# Altium schematic sheet Hammerhead - LPC4337 MCU R1.1.SchDoc
size C; SheetNumber: 2
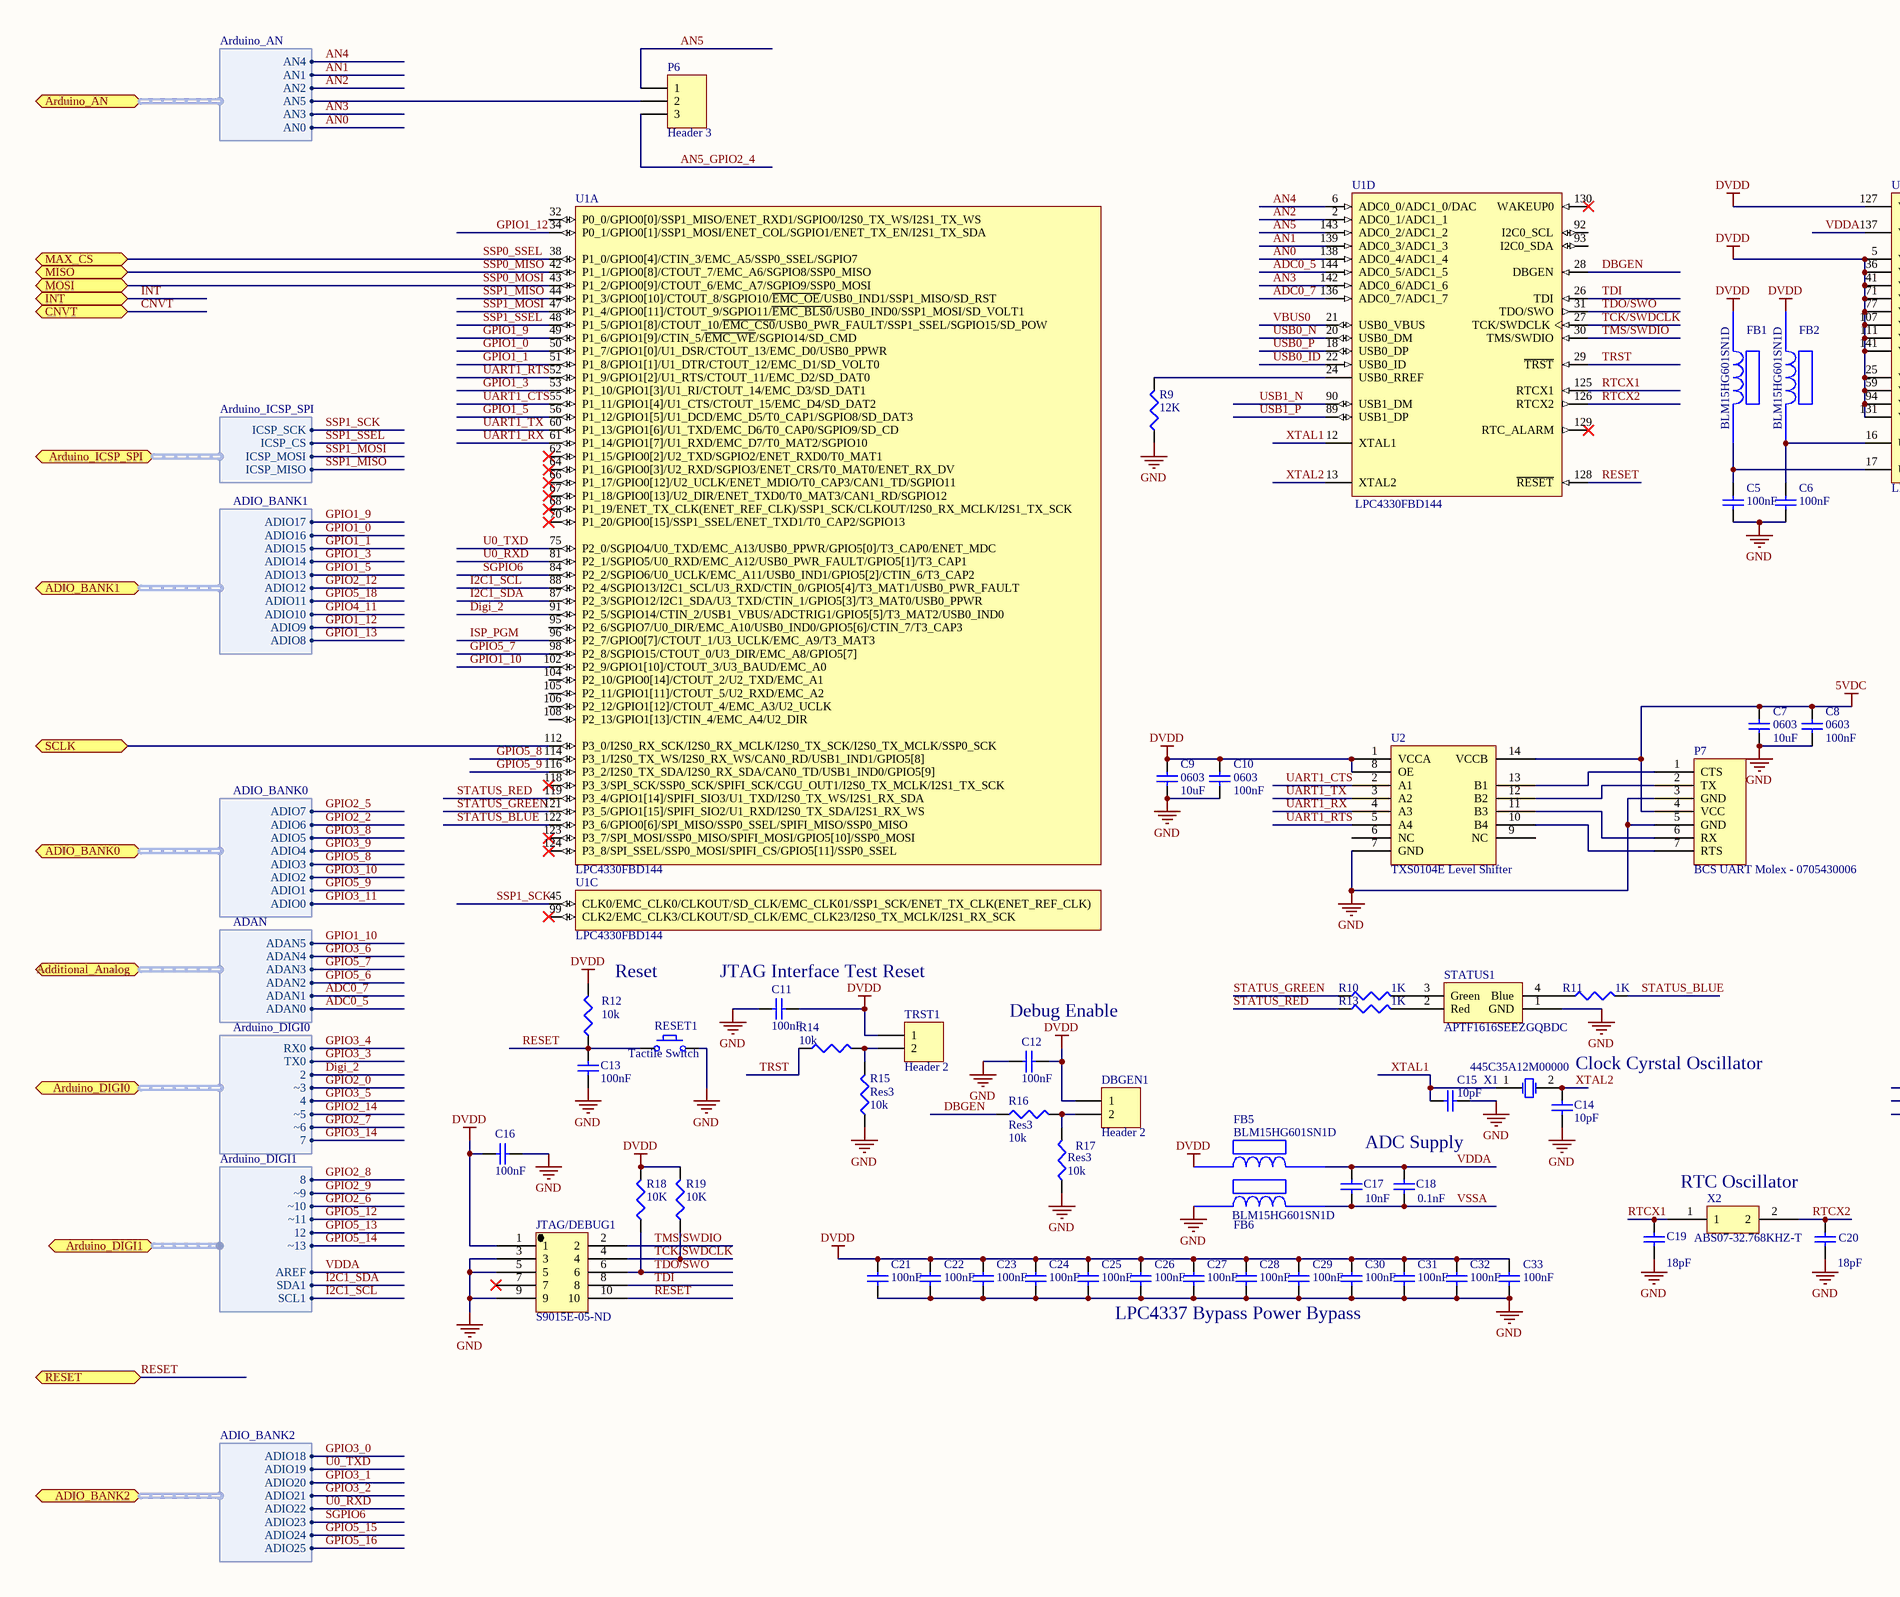
[diagram p0: Hammerhead - LPC4337 MCU R1.1.SchDoc, left]
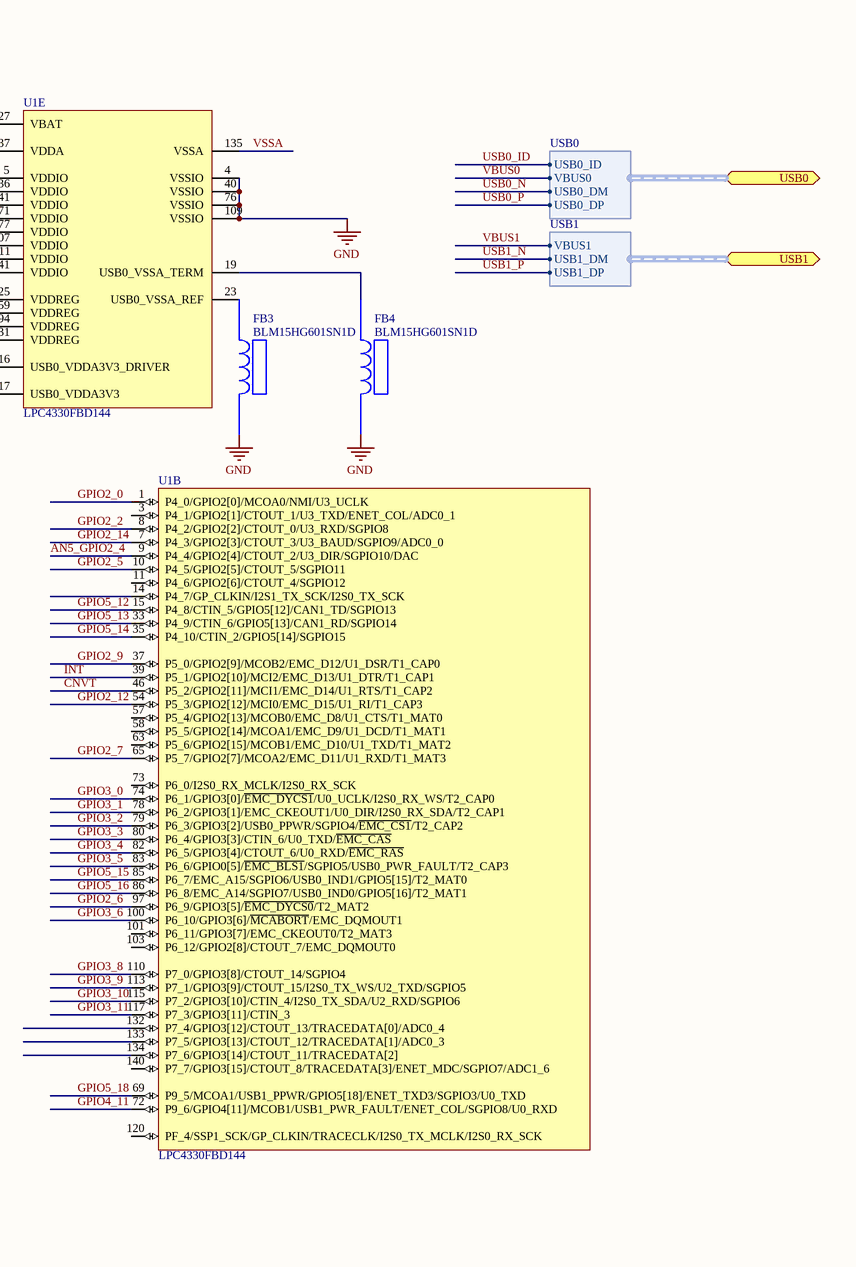
[diagram p1: Hammerhead - LPC4337 MCU R1.1.SchDoc, right]

## Parts
C5  value 100nF  [1608[0603]]  (hidden comment: Cap Semi)
C6  value 100nF  [1608[0603]]  (hidden comment: Cap Semi)
C7  0603  value 10uF  [1608[0603]]
C8  0603  value 100nF  [1608[0603]]
C9  0603  value 10uF  [1608[0603]]
C10  0603  value 100nF  [1608[0603]]
C11  value 100nF  [1608[0603]]  (hidden comment: Cap Semi)
C12  value 100nF  [1608[0603]]  (hidden comment: Cap Semi)
C13  value 100nF  [1608[0603]]  (hidden comment: Cap Semi)
C14  value 10pF  [1608[0603]]  (hidden comment: Cap Semi)
C15  value 10pF  [1608[0603]]  (hidden comment: Cap Semi)
C16  value 100nF  [1608[0603]]  (hidden comment: Cap Semi)
C17  value 10nF  [1608[0603]]  (hidden comment: Cap Semi)
C18  value 0.1nF  [1608[0603]]  (hidden comment: Cap Semi)
C19  value 18pF  [1608[0603]]  (hidden comment: Cap Semi)
C20  value 18pF  [1608[0603]]  (hidden comment: Cap Semi)
C21  value 100nF  [1608[0603]]  (hidden comment: Cap Semi)
C22  value 100nF  [1608[0603]]  (hidden comment: Cap Semi)
C23  value 100nF  [1608[0603]]  (hidden comment: Cap Semi)
C24  value 100nF  [1608[0603]]  (hidden comment: Cap Semi)
C25  value 100nF  [1608[0603]]  (hidden comment: Cap Semi)
C26  value 100nF  [1608[0603]]  (hidden comment: Cap Semi)
C27  value 100nF  [1608[0603]]  (hidden comment: Cap Semi)
C28  value 100nF  [1608[0603]]  (hidden comment: Cap Semi)
C29  value 100nF  [1608[0603]]  (hidden comment: Cap Semi)
C30  value 100nF  [1608[0603]]  (hidden comment: Cap Semi)
C31  value 100nF  [1608[0603]]  (hidden comment: Cap Semi)
C32  value 100nF  [1608[0603]]  (hidden comment: Cap Semi)
C33  value 100nF  [1608[0603]]  (hidden comment: Cap Semi)
DBGEN1  Header 2  [HDR1X2]
FB1  BLM15HG601SN1D  [BLM18PG121SN1D]
FB2  BLM15HG601SN1D  [BLM18PG121SN1D]
FB3  BLM15HG601SN1D  [BLM18PG121SN1D]
FB4  BLM15HG601SN1D  [BLM18PG121SN1D]
FB5  BLM15HG601SN1D  [BLM18PG121SN1D]
FB6  BLM15HG601SN1D  [BLM18PG121SN1D]
JTAG/DEBUG1  S9015E-05-ND  [S9015E-05-ND]
P6  Header 3  [HDR1X3]
P7  BCS UART Molex - 0705430006  [BCS Serial Port - Molex]
R9  value 12K  [J1-0603]  (hidden comment: Res3)
R10  value 1K  [J1-0603]  (hidden comment: Res3)
R11  value 1K  [J1-0603]  (hidden comment: Res3)
R12  value 10k  [J1-0603]  (hidden comment: Res3)
R13  value 1K  [J1-0603]  (hidden comment: Res3)
R14  value 10k  [J1-0603]  (hidden comment: Res3)
R15  Res3  value 10k  [J1-0603]
R16  Res3  value 10k  [J1-0603]
R17  Res3  value 10k  [J1-0603]
R18  value 10K  [J1-0603]  (hidden comment: Res3)
R19  value 10K  [J1-0603]  (hidden comment: Res3)
RESET1  Tactile Switch  [TL3301]
STATUS1  APTF1616SEEZGQBDC  [RGB LED APTF1616SEEZGQBDC]
TRST1  Header 2  [HDR1X2]
U1  LPC4330FBD144  [SOT486-1_V]  (parts A,B,C,D,E of 5)
U2  TXS0104E Level Shifter  [RGY  (S-PVQFN-N14)]
X1  445C35A12M00000  [445C35A12M00000]
X2  ABS07-32.768KHZ-T  [ABS07-32.768KHZ-T]

## Ports
Additional_Analog (harness ADAN), ADIO_BANK0 (harness ADIO_BANK0), ADIO_BANK1 (harness ADIO_BANK1), ADIO_BANK2 (harness ADIO_BANK2), Arduino_AN (harness Arduino_AN), Arduino_DIGI0 (harness Arduino_DIGI0), Arduino_DIGI1 (harness Arduino_DIGI1), Arduino_ICSP_SPI (harness Arduino_ICSP_SPI), CNVT, INT, MAX_CS, MISO, MOSI, RESET, SCLK, USB0 (harness USB0), USB1 (harness USB1)

## Harnesses
Arduino_AN: AN0, AN1, AN2, AN3, AN4, AN5
ADIO_BANK0: ADIO0, ADIO1, ADIO2, ADIO3, ADIO4, ADIO5, ADIO6, ADIO7
ADIO_BANK1: ADIO17, ADIO16, ADIO15, ADIO14, ADIO13, ADIO12, ADIO10, ADIO9, ADIO8, ADIO11
Arduino_DIGI0: 7, ~6, ~5, 4, ~3, 2, TX0, RX0
ADAN: ADAN0, ADAN1, ADAN2, ADAN3, ADAN4, ADAN5
USB1: VBUS1, USB1_DM, USB1_DP
USB0: USB0_ID, VBUS0, USB0_DM, USB0_DP
Arduino_ICSP_SPI: ICSP_MOSI, ICSP_MISO, ICSP_SCK, ICSP_CS
Arduino_DIGI1: 8, ~9, ~10, ~11, 12, ~13, AREF, SDA1, SCL1
ADIO_BANK2: ADIO18, ADIO19, ADIO20, ADIO21, ADIO22, ADIO23, ADIO24, ADIO25

## Nets
5VDC: C7.2 C8.2 P7.4(VCC) U2.14(VCCB)
DVDD: C9.2 C10.2 C11.2 C12.2 C16.1 C21.2 C22.2 C23.2 C24.2 C25.2 C26.2 C27.2 C28.2 C29.2 C30.2 C31.2 C32.2 C33.2 DBGEN1.1 FB1.1 FB2.1 FB5.1 JTAG/DEBUG1.1 R12.2 R18.2 R19.2 TRST1.1 U1.5(VDDIO) U1.25(VDDREG) U1.36(VDDIO) U1.41(VDDIO) U1.59(VDDREG) U1.71(VDDIO) U1.77(VDDIO) U1.94(VDDREG) U1.107(VDDIO) U1.111(VDDIO) U1.127(VBAT) U1.131(VDDREG) U1.141(VDDIO) U2.1(VCCA) U2.8(OE)
GND: C5.1 C6.1 C7.1 C8.1 C9.1 C10.1 C11.1 C12.1 C13.1 C14.1 C15.1 C16.2 C19.1 C20.1 C21.1 C22.1 C23.1 C24.1 C25.1 C26.1 C27.1 C28.1 C29.1 C30.1 C31.1 C32.1 C33.1 FB3.2 FB4.2 FB6.1 JTAG/DEBUG1.3 JTAG/DEBUG1.5 JTAG/DEBUG1.9 P7.3(GND) P7.5(GND) R9.1 R15.1 R17.1 RESET1.2 STATUS1.1(GND) U1.4(VSSIO) U1.40(VSSIO) U1.76(VSSIO) U1.109(VSSIO) U2.7(GND)
ADC0_5: U1.144(ADC0_5/ADC1_5) ; port Additional_Analog.ADAN0
ADC0_7: U1.136(ADC0_7/ADC1_7) ; port Additional_Analog.ADAN1
AN0: U1.138(ADC0_4/ADC1_4) ; port Arduino_AN.AN0
AN1: U1.139(ADC0_3/ADC1_3) ; port Arduino_AN.AN1
AN2: U1.2(ADC0_1/ADC1_1) ; port Arduino_AN.AN2
AN3: U1.142(ADC0_6/ADC1_6) ; port Arduino_AN.AN3
AN4: U1.6(ADC0_0/ADC1_0/DAC) ; port Arduino_AN.AN4
AN5: P6.1 U1.143(ADC0_2/ADC1_2)
AN5_GPIO2_4: P6.3 U1.9(P4_4/GPIO2[4]/CTOUT_2/U3_DIR/SGPIO10/DAC)
CNVT: U1.46(P5_2/GPIO2[11]/MCI1/EMC_D14/U1_RTS/T1_CAP2) ; port CNVT
DBGEN: R16.1 U1.28(DBGEN)
Digi_2: U1.91(P2_5/SGPIO14/CTIN_2/USB1_VBUS/ADCTRIG1/GPIO5[5]/T3_MAT2/USB0_IND0) ; port Arduino_DIGI0.2
GPIO1_0: U1.50(P1_7/GPIO1[0]/U1_DSR/CTOUT_13/EMC_D0/USB0_PPWR) ; port ADIO_BANK1.ADIO16
GPIO1_1: U1.51(P1_8/GPIO1[1]/U1_DTR/CTOUT_12/EMC_D1/SD_VOLT0) ; port ADIO_BANK1.ADIO15
GPIO1_3: U1.53(P1_10/GPIO1[3]/U1_RI/CTOUT_14/EMC_D3/SD_DAT1) ; port ADIO_BANK1.ADIO14
GPIO1_5: U1.56(P1_12/GPIO1[5]/U1_DCD/EMC_D5/T0_CAP1/SGPIO8/SD_DAT3) ; port ADIO_BANK1.ADIO13
GPIO1_9: U1.49(P1_6/GPIO1[9]/CTIN_5/~{EMC_WE}/SGPIO14/SD_CMD) ; port ADIO_BANK1.ADIO17
GPIO1_10: U1.102(P2_9/GPIO1[10]/CTOUT_3/U3_BAUD/EMC_A0) ; port Additional_Analog.ADAN5
GPIO1_12: U1.34(P0_1/GPIO0[1]/SSP1_MOSI/ENET_COL/SGPIO1/ENET_TX_EN/I2S1_TX_SDA) ; port ADIO_BANK1.ADIO9
GPIO1_13: port ADIO_BANK1.ADIO8
GPIO2_0: U1.1(P4_0/GPIO2[0]/MCOA0/NMI/U3_UCLK) ; port Arduino_DIGI0.~3
GPIO2_2: U1.8(P4_2/GPIO2[2]/CTOUT_0/U3_RXD/SGPIO8) ; port ADIO_BANK0.ADIO6
GPIO2_5: U1.10(P4_5/GPIO2[5]/CTOUT_5/SGPIO11) ; port ADIO_BANK0.ADIO7
GPIO2_6: U1.97(P6_9/GPIO3[5]/~{EMC_DYCS0}/T2_MAT2) ; port Arduino_DIGI1.~10
GPIO2_7: U1.65(P5_7/GPIO2[7]/MCOA2/EMC_D11/U1_RXD/T1_MAT3) ; port Arduino_DIGI0.~6
GPIO2_8: port Arduino_DIGI1.8
GPIO2_9: U1.37(P5_0/GPIO2[9]/MCOB2/EMC_D12/U1_DSR/T1_CAP0) ; port Arduino_DIGI1.~9
GPIO2_12: U1.54(P5_3/GPIO2[12]/MCI0/EMC_D15/U1_RI/T1_CAP3) ; port ADIO_BANK1.ADIO12
GPIO2_14: U1.7(P4_3/GPIO2[3]/CTOUT_3/U3_BAUD/SGPIO9/ADC0_0) ; port Arduino_DIGI0.~5
GPIO3_0: U1.74(P6_1/GPIO3[0]/~{EMC_DYCS1}/U0_UCLK/I2S0_RX_WS/T2_CAP0) ; port ADIO_BANK2.ADIO18
GPIO3_1: U1.78(P6_2/GPIO3[1]/EMC_CKEOUT1/U0_DIR/I2S0_RX_SDA/T2_CAP1) ; port ADIO_BANK2.ADIO20
GPIO3_2: U1.79(P6_3/GPIO3[2]/USB0_PPWR/SGPIO4/~{EMC_CS1}/T2_CAP2) ; port ADIO_BANK2.ADIO21
GPIO3_3: U1.80(P6_4/GPIO3[3]/CTIN_6/U0_TXD/~{EMC_CAS}) ; port Arduino_DIGI0.TX0
GPIO3_4: U1.82(P6_5/GPIO3[4]/CTOUT_6/U0_RXD/~{EMC_RAS}) ; port Arduino_DIGI0.RX0
GPIO3_5: U1.83(P6_6/GPIO0[5]/~{EMC_BLS1}/SGPIO5/USB0_PWR_FAULT/T2_CAP3) ; port Arduino_DIGI0.4
GPIO3_6: U1.100(P6_10/GPIO3[6]/~{MCABORT}/EMC_DQMOUT1) ; port Additional_Analog.ADAN4
GPIO3_8: U1.110(P7_0/GPIO3[8]/CTOUT_14/SGPIO4) ; port ADIO_BANK0.ADIO5
GPIO3_9: U1.113(P7_1/GPIO3[9]/CTOUT_15/I2S0_TX_WS/U2_TXD/SGPIO5) ; port ADIO_BANK0.ADIO4
GPIO3_10: U1.115(P7_2/GPIO3[10]/CTIN_4/I2S0_TX_SDA/U2_RXD/SGPIO6) ; port ADIO_BANK0.ADIO2
GPIO3_11: U1.117(P7_3/GPIO3[11]/CTIN_3) ; port ADIO_BANK0.ADIO0
GPIO3_14: port Arduino_DIGI0.7
GPIO4_11: U1.72(P9_6/GPIO4[11]/MCOB1/USB1_PWR_FAULT/ENET_COL/SGPIO8/U0_RXD) ; port ADIO_BANK1.ADIO10
GPIO5_6: port Additional_Analog.ADAN2
GPIO5_7: U1.98(P2_8/SGPIO15/CTOUT_0/U3_DIR/EMC_A8/GPIO5[7]) ; port Additional_Analog.ADAN3
GPIO5_8: U1.114(P3_1/I2S0_TX_WS/I2S0_RX_WS/CAN0_RD/USB1_IND1/GPIO5[8]) ; port ADIO_BANK0.ADIO3
GPIO5_9: U1.116(P3_2/I2S0_TX_SDA/I2S0_RX_SDA/CAN0_TD/USB1_IND0/GPIO5[9]) ; port ADIO_BANK0.ADIO1
GPIO5_12: U1.15(P4_8/CTIN_5/GPIO5[12]/CAN1_TD/SGPIO13) ; port Arduino_DIGI1.~11
GPIO5_13: U1.33(P4_9/CTIN_6/GPIO5[13]/CAN1_RD/SGPIO14) ; port Arduino_DIGI1.12
GPIO5_14: U1.35(P4_10/CTIN_2/GPIO5[14]/SGPIO15) ; port Arduino_DIGI1.~13
GPIO5_15: U1.85(P6_7/EMC_A15/SGPIO6/USB0_IND1/GPIO5[15]/T2_MAT0) ; port ADIO_BANK2.ADIO24
GPIO5_16: U1.86(P6_8/EMC_A14/SGPIO7/USB0_IND0/GPIO5[16]/T2_MAT1) ; port ADIO_BANK2.ADIO25
GPIO5_18: U1.69(P9_5/MCOA1/USB1_PPWR/GPIO5[18]/ENET_TXD3/SGPIO3/U0_TXD) ; port ADIO_BANK1.ADIO11
I2C1_SCL: U1.88(P2_4/SGPIO13/I2C1_SCL/U3_RXD/CTIN_0/GPIO5[4]/T3_MAT1/USB0_PWR_FAULT) ; port Arduino_DIGI1.SCL1
I2C1_SDA: U1.87(P2_3/SGPIO12/I2C1_SDA/U3_TXD/CTIN_1/GPIO5[3]/T3_MAT0/USB0_PPWR) ; port Arduino_DIGI1.SDA1
INT: U1.39(P5_1/GPIO2[10]/MCI2/EMC_D13/U1_DTR/T1_CAP1) ; port INT
ISP_PGM: U1.96(P2_7/GPIO0[7]/CTOUT_1/U3_UCLK/EMC_A9/T3_MAT3)
RESET: C13.2 JTAG/DEBUG1.10 R12.1 RESET1.1 U1.128(~{RESET}) ; port RESET
RTCX1: C19.2 U1.125(RTCX1) X2.1
RTCX2: C20.2 U1.126(RTCX2) X2.2
SCLK: U1.112(P3_0/I2S0_RX_SCK/I2S0_RX_MCLK/I2S0_TX_SCK/I2S0_TX_MCLK/SSP0_SCK) ; port SCLK
SGPIO6: U1.84(P2_2/SGPIO6/U0_UCLK/EMC_A11/USB0_IND1/GPIO5[2]/CTIN_6/T3_CAP2) ; port ADIO_BANK2.ADIO23
SSP0_MISO: U1.42(P1_1/GPIO0[8]/CTOUT_7/EMC_A6/SGPIO8/SSP0_MISO) ; port MISO
SSP0_MOSI: U1.43(P1_2/GPIO0[9]/CTOUT_6/EMC_A7/SGPIO9/SSP0_MOSI) ; port MOSI
SSP0_SSEL: U1.38(P1_0/GPIO0[4]/CTIN_3/EMC_A5/SSP0_SSEL/SGPIO7) ; port MAX_CS
SSP1_MISO: U1.44(P1_3/GPIO0[10]/CTOUT_8/SGPIO10/~{EMC_OE}/USB0_IND1/SSP1_MISO/SD_RST) ; port Arduino_ICSP_SPI.ICSP_MISO
SSP1_MOSI: U1.47(P1_4/GPIO0[11]/CTOUT_9/SGPIO11/~{EMC_BLS0}/USB0_IND0/SSP1_MOSI/SD_VOLT1) ; port Arduino_ICSP_SPI.ICSP_MOSI
SSP1_SCK: U1.45(CLK0/EMC_CLK0/CLKOUT/SD_CLK/EMC_CLK01/SSP1_SCK/ENET_TX_CLK(ENET_REF_CLK)) ; port Arduino_ICSP_SPI.ICSP_SCK
SSP1_SSEL: U1.48(P1_5/GPIO1[8]/CTOUT_10/~{EMC_CS0}/USB0_PWR_FAULT/SSP1_SSEL/SGPIO15/SD_POW) ; port Arduino_ICSP_SPI.ICSP_CS
STATUS_BLUE: R11.2 U1.122(P3_6/GPIO0[6]/SPI_MISO/SSP0_SSEL/SPIFI_MISO/SSP0_MISO)
STATUS_GREEN: R10.1 U1.121(P3_5/GPIO1[15]/SPIFI_SIO2/U1_RXD/I2S0_TX_SDA/I2S1_RX_WS)
STATUS_RED: R13.1 U1.119(P3_4/GPIO1[14]/SPIFI_SIO3/U1_TXD/I2S0_TX_WS/I2S1_RX_SDA)
TCK/SWDCLK: JTAG/DEBUG1.4 R19.1 U1.27(TCK/SWDCLK)
TDI: JTAG/DEBUG1.8 U1.26(TDI)
TDO/SWO: JTAG/DEBUG1.6 R18.1 U1.31(TDO/SWO)
TMS/SWDIO: JTAG/DEBUG1.2 U1.30(TMS/SWDIO)
TRST: R14.1 U1.29(~{TRST})
U0_RXD: U1.81(P2_1/SGPIO5/U0_RXD/EMC_A12/USB0_PWR_FAULT/GPIO5[1]/T3_CAP1) ; port ADIO_BANK2.ADIO22
U0_TXD: U1.75(P2_0/SGPIO4/U0_TXD/EMC_A13/USB0_PPWR/GPIO5[0]/T3_CAP0/ENET_MDC) ; port ADIO_BANK2.ADIO19
UART1_CTS: U1.55(P1_11/GPIO1[4]/U1_CTS/CTOUT_15/EMC_D4/SD_DAT2) U2.2(A1)
UART1_RTS: U1.52(P1_9/GPIO1[2]/U1_RTS/CTOUT_11/EMC_D2/SD_DAT0) U2.5(A4)
UART1_RX: U1.61(P1_14/GPIO1[7]/U1_RXD/EMC_D7/T0_MAT2/SGPIO10) U2.4(A3)
UART1_TX: U1.60(P1_13/GPIO1[6]/U1_TXD/EMC_D6/T0_CAP0/SGPIO9/SD_CD) U2.3(A2)
USB0_ID: U1.22(USB0_ID) ; port USB0.USB0_ID
USB0_N: U1.20(USB0_DM) ; port USB0.USB0_DM
USB0_P: U1.18(USB0_DP) ; port USB0.USB0_DP
USB1_N: U1.90(USB1_DM) ; port USB1.USB1_DM
USB1_P: U1.89(USB1_DP) ; port USB1.USB1_DP
VBUS0: U1.21(USB0_VBUS) ; port USB0.VBUS0
VBUS1: port USB1.VBUS1
VDDA: C17.2 C18.2 FB5.2 U1.137(VDDA) ; port Arduino_DIGI1.AREF
VSSA: C17.1 C18.1 FB6.2 U1.135(VSSA)
XTAL1: C15.2 U1.12(XTAL1) X1.1(OSC1)
XTAL2: C14.2 U1.13(XTAL2) X1.2(OSC2)
NetC5_2: C5.2 FB1.2 U1.17(USB0_VDDA3V3)
NetC6_2: C6.2 FB2.2 U1.16(USB0_VDDA3V3_DRIVER)
NetDBGEN1_2: DBGEN1.2 R16.2 R17.2
NetFB3_1: FB3.1 U1.23(USB0_VSSA_REF)
NetFB4_1: FB4.1 U1.19(USB0_VSSA_TERM)
NetP6_2: P6.2 ; port Arduino_AN.AN5
NetP7_1: P7.1(CTS) U2.13(B1)
NetP7_2: P7.2(TX) U2.12(B2)
NetP7_6: P7.6(RX) U2.11(B3)
NetP7_7: P7.7(RTS) U2.10(B4)
NetR9_2: R9.2 U1.24(USB0_RREF)
NetR10_2: R10.2 STATUS1.3(Green)
NetR11_1: R11.1 STATUS1.4(Blue)
NetR13_2: R13.2 STATUS1.2(Red)
NetR14_2: R14.2 R15.2 TRST1.2

Not connected (* = marked no-connect by the designer): JTAG/DEBUG1 7*; U1 3(P4_1/GPIO2[1]/CTOUT_1/U3_TXD/ENET_COL/ADC0_1) 11(P4_6/GPIO2[6]/CTOUT_4/SGPIO12) 14(P4_7/GP_CLKIN/I2S1_TX_SCK/I2S0_TX_SCK) 32(P0_0/GPIO0[0]/SSP1_MISO/ENET_RXD1/SGPIO0/I2S0_TX_WS/I2S1_TX_WS) 57(P5_4/GPIO2[13]/MCOB0/EMC_D8/U1_CTS/T1_MAT0) 58(P5_5/GPIO2[14]/MCOA1/EMC_D9/U1_DCD/T1_MAT1) 62(P1_15/GPIO0[2]/U2_TXD/SGPIO2/ENET_RXD0/T0_MAT1)* 63(P5_6/GPIO2[15]/MCOB1/EMC_D10/U1_TXD/T1_MAT2) 64(P1_16/GPIO0[3]/U2_RXD/SGPIO3/ENET_CRS/T0_MAT0/ENET_RX_DV)* 66(P1_17/GPIO0[12]/U2_UCLK/ENET_MDIO/T0_CAP3/CAN1_TD/SGPIO11)* 67(P1_18/GPIO0[13]/U2_DIR/ENET_TXD0/T0_MAT3/CAN1_RD/SGPIO12)* 68(P1_19/ENET_TX_CLK(ENET_REF_CLK)/SSP1_SCK/CLKOUT/I2S0_RX_MCLK/I2S1_TX_SCK)* 70(P1_20/GPIO0[15]/SSP1_SSEL/ENET_TXD1/T0_CAP2/SGPIO13)* 73(P6_0/I2S0_RX_MCLK/I2S0_RX_SCK) 92(I2C0_SCL) 93(I2C0_SDA) 95(P2_6/SGPIO7/U0_DIR/EMC_A10/USB0_IND0/GPIO5[6]/CTIN_7/T3_CAP3) 99(CLK2/EMC_CLK3/CLKOUT/SD_CLK/EMC_CLK23/I2S0_TX_MCLK/I2S1_RX_SCK)* 101(P6_11/GPIO3[7]/EMC_CKEOUT0/T2_MAT3) 103(P6_12/GPIO2[8]/CTOUT_7/EMC_DQMOUT0) 104(P2_10/GPIO0[14]/CTOUT_2/U2_TXD/EMC_A1) 105(P2_11/GPIO1[11]/CTOUT_5/U2_RXD/EMC_A2) 106(P2_12/GPIO1[12]/CTOUT_4/EMC_A3/U2_UCLK) 108(P2_13/GPIO1[13]/CTIN_4/EMC_A4/U2_DIR) 118(P3_3/SPI_SCK/SSP0_SCK/SPIFI_SCK/CGU_OUT1/I2S0_TX_MCLK/I2S1_TX_SCK)* 120(PF_4/SSP1_SCK/GP_CLKIN/TRACECLK/I2S0_TX_MCLK/I2S0_RX_SCK) 123(P3_7/SPI_MOSI/SSP0_MISO/SPIFI_MOSI/GPIO5[10]/SSP0_MOSI)* 124(P3_8/SPI_SSEL/SSP0_MOSI/SPIFI_CS/GPIO5[11]/SSP0_SSEL)* 129(RTC_ALARM)* 130(WAKEUP0)* 132(P7_4/GPIO3[12]/CTOUT_13/TRACEDATA[0]/ADC0_4) 133(P7_5/GPIO3[13]/CTOUT_12/TRACEDATA[1]/ADC0_3) 134(P7_6/GPIO3[14]/CTOUT_11/TRACEDATA[2]) 140(P7_7/GPIO3[15]/CTOUT_8/TRACEDATA[3]/ENET_MDC/SGPIO7/ADC1_6); U2 6(NC) 9(NC)

## Notes on the sheet
- (near R12) Reset
- (near C11) JTAG Interface Test Reset
- (near C12) Debug Enable
- Clock Cyrstal Oscillator
- ADC Supply
- RTC Oscillator
- LPC4337 Bypass Power Bypass

## Library data of the parts
C5-C33 = Cap Semi: Capacitor (Semiconductor SIM Model); Published: 8-Jun-2000; LatestRevisionDate: 29-May-2009; LatestRevisionNote: IPC-7351 Footprint Added.; PackageReference: C1206; Publisher: Altium Limited; PackageDescription: Chip Capacitor
DBGEN1 TRST1 = Header 2: Header, 2-Pin; LatestRevisionDate: 17-Jul-2002; LatestRevisionNote: Re-released for DXP Platform.; Publisher: Altium Limited
P6 = Header 3: Header, 3-Pin; LatestRevisionDate: 17-Jul-2002; LatestRevisionNote: Re-released for DXP Platform.; Publisher: Altium Limited
P7 = BCS Serial Port - Molex: BCS UART Port Molex
R9-R19 = Res3: Resistor; Published: 8-Jun-2000; LatestRevisionDate: 29-May-2009; LatestRevisionNote: IPC-7351 Footprint Added.; PackageReference: J1-0603; Publisher: Altium Limited; PackageDescription: Chip Resistor
STATUS1 = RGB LED APTF1616SEEZGQBDC: RGB LED
U1 = LPC4330FBD144: 32-bit ARM Cortex-M4 MCU, 264 kB SRAM, 2 HS USB with on-chip PHY, Ethernet, CAN, AES, SPIFI, SGPIO, SCT, 144-Pin LQFP; fmax: 204 MHz; GPIOs: 83; SRAM: 264 kB; ROM: 64 kB; Ethernet: Y; USB: 2; ADC channels: 8; SPI: 1; UART: 4; VDD (min): 2.2 V; VDD (max): 3.6 V; Code_IEC: 136E23; DatasheetVersion: Rev.3.1, Jan-2012; PackageVersion: Feb-2003; PackageReference: SOT486-1; PackageDescription: LQFP144: Plastic Low Profile Quad Flat Package; 144 Leads; Body 20 x 20 x 1.4 mm; PWM: Y; PLL: Y; I2C: 2; CAN: 2; Timers: 4; Code_JEDEC: MS-026; ComponentLink1Description: Manufacturer URL; ComponentLink1URL: http://www.nxp.com/; ComponentLink2Description: Datasheet; ComponentLink2URL: http://www.nxp.com/documents/data_sheet/LPC4350_30_20_10.pdf
U2 = TXS0104E: TXS0104E - Bidriectional Opendrain/pushpull level shift
X1 = XTAL: Crystal Oscillator; Published: 8-Jun-2000; LatestRevisionDate: 17-Jul-2002; LatestRevisionNote: Re-released for DXP Platform.; PackageReference: R38; Publisher: Altium Limited; PackageDescription: Crystal, Thru-Hole; 2 Leads; Body 3.1 x 8.2 mm (Dia.xH)
X2 = ABS07-32.768KHZ-T: ABS07-32.768KHZ-T RTC Crystal Oscillator